# Altium schematic sheet MercAp PCB.SchDoc: EDP_Schematic
size A3 portrait; DocumentNumber: 1; Revision: 1; SheetNumber: 1; SheetTotal: 1; ENG_APP_DATE: --/--/--; DSN_APP_DATE: --/--/--; CHK_APP_DATE: --/--/--
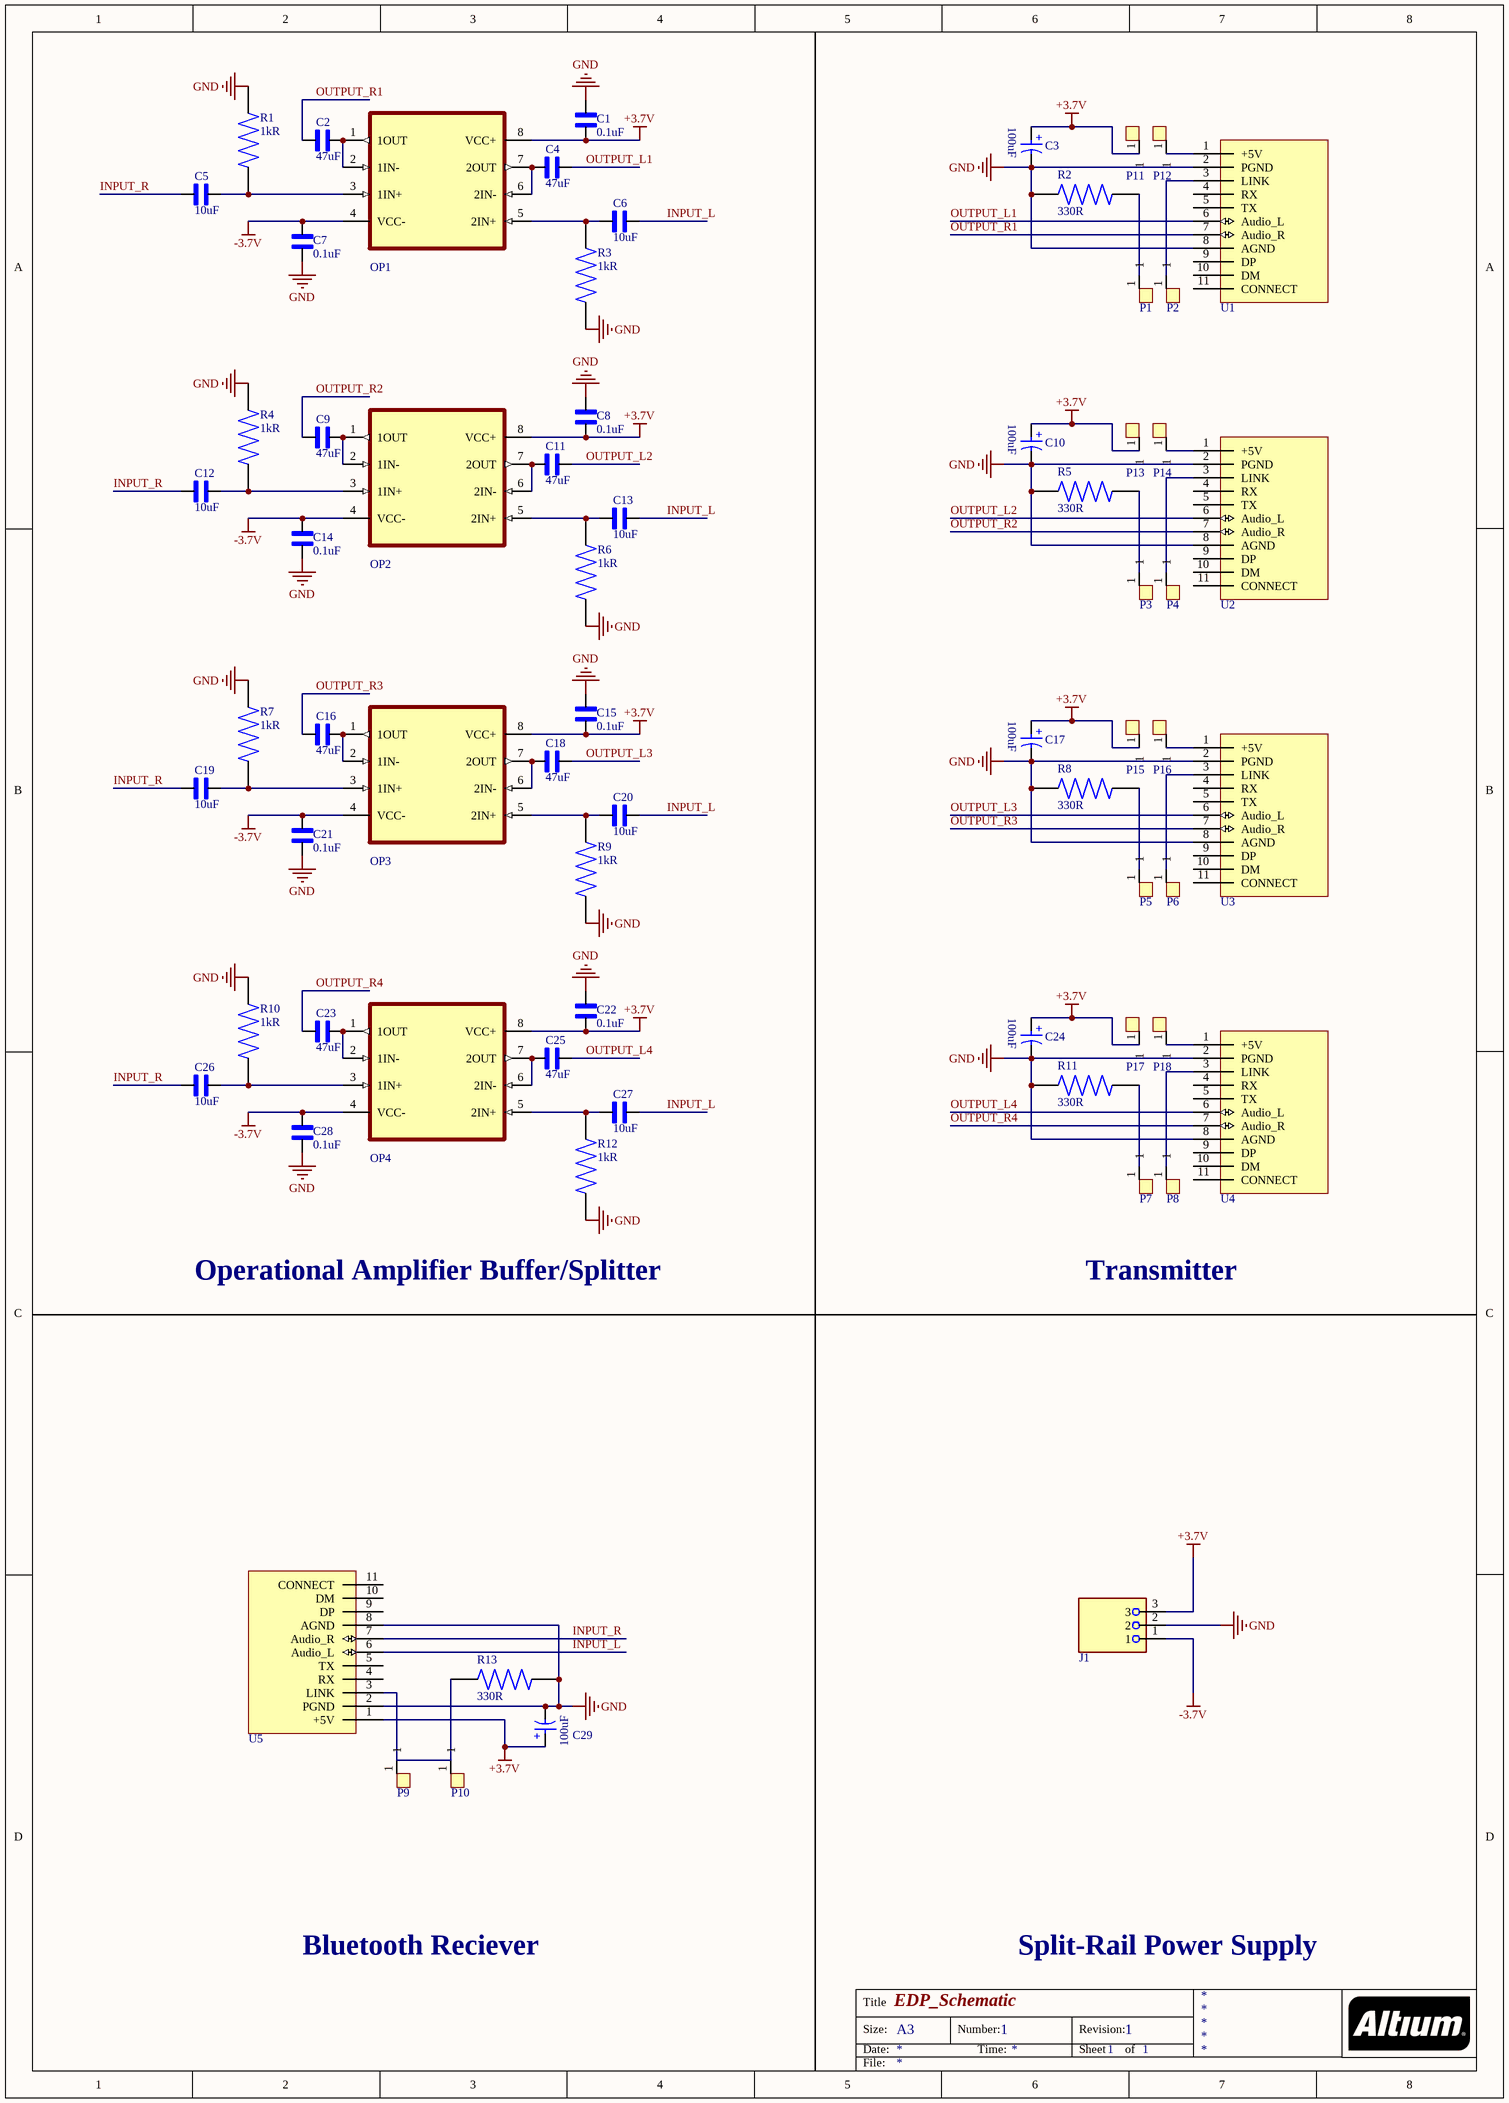
[diagram p0: MercAp PCB.SchDoc]

## Parts
C1  value 0.1uF  [CAPC1005X55N]  (hidden comment: CL05B104KP5NNNC)
C2  value 47uF  [CAPC2012X145N]  (hidden comment: JMK212BBJ476MG-T)
C3  865080343009  [WCAP-ASLI_D6.3H5.5]  (value not drawn)
C4  value 47uF  [CAPC2012X145N]  (hidden comment: JMK212BBJ476MG-T)
C5  value 10uF  [CAPC2012X135N]  (hidden comment: GRM21BR61C106KE15K)
C6  value 10uF  [CAPC2012X135N]  (hidden comment: GRM21BR61C106KE15K)
C7  value 0.1uF  [CAPC1005X55N]  (hidden comment: CL05B104KP5NNNC)
C8  value 0.1uF  [CAPC1005X55N]  (hidden comment: CL05B104KP5NNNC)
C9  value 47uF  [CAPC2012X145N]  (hidden comment: JMK212BBJ476MG-T)
C10  865080343009  [WCAP-ASLI_D6.3H5.5]  (value not drawn)
C11  value 47uF  [CAPC2012X145N]  (hidden comment: JMK212BBJ476MG-T)
C12  value 10uF  [CAPC2012X135N]  (hidden comment: GRM21BR61C106KE15K)
C13  value 10uF  [CAPC2012X135N]  (hidden comment: GRM21BR61C106KE15K)
C14  value 0.1uF  [CAPC1005X55N]  (hidden comment: CL05B104KP5NNNC)
C15  value 0.1uF  [CAPC1005X55N]  (hidden comment: CL05B104KP5NNNC)
C16  value 47uF  [CAPC2012X145N]  (hidden comment: JMK212BBJ476MG-T)
C17  865080343009  [WCAP-ASLI_D6.3H5.5]  (value not drawn)
C18  value 47uF  [CAPC2012X145N]  (hidden comment: JMK212BBJ476MG-T)
C19  value 10uF  [CAPC2012X135N]  (hidden comment: GRM21BR61C106KE15K)
C20  value 10uF  [CAPC2012X135N]  (hidden comment: GRM21BR61C106KE15K)
C21  value 0.1uF  [CAPC1005X55N]  (hidden comment: CL05B104KP5NNNC)
C22  value 0.1uF  [CAPC1005X55N]  (hidden comment: CL05B104KP5NNNC)
C23  value 47uF  [CAPC2012X145N]  (hidden comment: JMK212BBJ476MG-T)
C24  865080343009  [WCAP-ASLI_D6.3H5.5]  (value not drawn)
C25  value 47uF  [CAPC2012X145N]  (hidden comment: JMK212BBJ476MG-T)
C26  value 10uF  [CAPC2012X135N]  (hidden comment: GRM21BR61C106KE15K)
C27  value 10uF  [CAPC2012X135N]  (hidden comment: GRM21BR61C106KE15K)
C28  value 0.1uF  [CAPC1005X55N]  (hidden comment: CL05B104KP5NNNC)
C29  865080343009  [WCAP-ASLI_D6.3H5.5]  (value not drawn)
J1  1935174  [PHOENIX_1935174]  (value not drawn)
OP1  NE5532DR  [SOIC127P599X175-8N]  (value not drawn)
OP2  NE5532DR  [SOIC127P599X175-8N]  (value not drawn)
OP3  NE5532DR  [SOIC127P599X175-8N]  (value not drawn)
OP4  NE5532DR  [SOIC127P599X175-8N]  (value not drawn)
P1  LED_PAD  [SolderWirePad_1x01_SMD_5x10mm]  (value not drawn)
P2  LED_PAD  [SolderWirePad_1x01_SMD_5x10mm]  (value not drawn)
P3  LED_PAD  [SolderWirePad_1x01_SMD_5x10mm]  (value not drawn)
P4  LED_PAD  [SolderWirePad_1x01_SMD_5x10mm]  (value not drawn)
P5  LED_PAD  [SolderWirePad_1x01_SMD_5x10mm]  (value not drawn)
P6  LED_PAD  [SolderWirePad_1x01_SMD_5x10mm]  (value not drawn)
P7  LED_PAD  [SolderWirePad_1x01_SMD_5x10mm]  (value not drawn)
P8  LED_PAD  [SolderWirePad_1x01_SMD_5x10mm]  (value not drawn)
P9  LED_PAD  [SolderWirePad_1x01_SMD_5x10mm]  (value not drawn)
P10  LED_PAD  [SolderWirePad_1x01_SMD_5x10mm]  (value not drawn)
P11  LED_PAD  [SolderWirePad_1x01_SMD_5x10mm]  (value not drawn)
P12  LED_PAD  [SolderWirePad_1x01_SMD_5x10mm]  (value not drawn)
P13  LED_PAD  [SolderWirePad_1x01_SMD_5x10mm]  (value not drawn)
P14  LED_PAD  [SolderWirePad_1x01_SMD_5x10mm]  (value not drawn)
P15  LED_PAD  [SolderWirePad_1x01_SMD_5x10mm]  (value not drawn)
P16  LED_PAD  [SolderWirePad_1x01_SMD_5x10mm]  (value not drawn)
P17  LED_PAD  [SolderWirePad_1x01_SMD_5x10mm]  (value not drawn)
P18  LED_PAD  [SolderWirePad_1x01_SMD_5x10mm]  (value not drawn)
R1  value 1kR  [RESC1508X55N]  (hidden comment: RMCF0603FT1K00)
R2  value 330R  [RESC1608X55N]  (hidden comment: RC0603JR-07330RL)
R3  value 1kR  [RESC1508X55N]  (hidden comment: RMCF0603FT1K00)
R4  value 1kR  [RESC1508X55N]  (hidden comment: RMCF0603FT1K00)
R5  value 330R  [RESC1608X55N]  (hidden comment: RC0603JR-07330RL)
R6  value 1kR  [RESC1508X55N]  (hidden comment: RMCF0603FT1K00)
R7  value 1kR  [RESC1508X55N]  (hidden comment: RMCF0603FT1K00)
R8  value 330R  [RESC1608X55N]  (hidden comment: RC0603JR-07330RL)
R9  value 1kR  [RESC1508X55N]  (hidden comment: RMCF0603FT1K00)
R10  value 1kR  [RESC1508X55N]  (hidden comment: RMCF0603FT1K00)
R11  value 330R  [RESC1608X55N]  (hidden comment: RC0603JR-07330RL)
R12  value 1kR  [RESC1508X55N]  (hidden comment: RMCF0603FT1K00)
R13  value 330R  [RESC1608X55N]  (hidden comment: RC0603JR-07330RL)
U1  KCX_BT_v1.4  [kcx_bt_emitter_foot]  (value not drawn)
U2  KCX_BT_v1.4  [kcx_bt_emitter_foot]  (value not drawn)
U3  KCX_BT_v1.4  [kcx_bt_emitter_foot]  (value not drawn)
U4  KCX_BT_v1.4  [kcx_bt_emitter_foot]  (value not drawn)
U5  KCX_BT_v1.4  [kcx_bt_emitter_foot]  (value not drawn)

## Nets
+3.7V: C1.1 C3.1(P) C8.1 C10.1(P) C15.1 C17.1(P) C22.1 C24.1(P) C29.1(P) J1.3 OP1.8(VCC+) OP2.8(VCC+) OP3.8(VCC+) OP4.8(VCC+) U5.1(+5V)
-3.7V: C7.2 C14.2 C21.2 C28.2 J1.1 OP1.4(VCC-) OP2.4(VCC-) OP3.4(VCC-) OP4.4(VCC-)
GND: C1.2 C3.2(N) C7.1 C8.2 C10.2(N) C14.1 C15.2 C17.2(N) C21.1 C22.2 C24.2(N) C28.1 C29.2(N) J1.2 R1.1 R2.1 R3.1 R4.1 R5.1 R6.1 R7.1 R8.1 R9.1 R10.1 R11.1 R12.1 R13.1 U1.2(PGND) U1.8(AGND) U2.2(PGND) U2.8(AGND) U3.2(PGND) U3.8(AGND) U4.2(PGND) U4.8(AGND) U5.2(PGND) U5.8(AGND)
INPUT_L: C6.1 C13.1 C20.1 C27.1 U5.6(Audio_L)
INPUT_R: C5.1 C12.1 C19.1 C26.1 U5.7(Audio_R)
OUTPUT_L1: C4.2 U1.6(Audio_L)
OUTPUT_L2: C11.2 U2.6(Audio_L)
OUTPUT_L3: C18.2 U3.6(Audio_L)
OUTPUT_L4: C25.2 U4.6(Audio_L)
OUTPUT_R1: C2.1 U1.7(Audio_R)
OUTPUT_R2: C9.1 U2.7(Audio_R)
OUTPUT_R3: C16.1 U3.7(Audio_R)
OUTPUT_R4: C23.1 U4.7(Audio_R)
NetC2_2: C2.2 OP1.1(1OUT) OP1.2(1IN-)
NetC4_1: C4.1 OP1.6(2IN-) OP1.7(2OUT)
NetC5_2: C5.2 OP1.3(1IN+) R1.2
NetC6_2: C6.2 OP1.5(2IN+) R3.2
NetC9_2: C9.2 OP2.1(1OUT) OP2.2(1IN-)
NetC11_1: C11.1 OP2.6(2IN-) OP2.7(2OUT)
NetC12_2: C12.2 OP2.3(1IN+) R4.2
NetC13_2: C13.2 OP2.5(2IN+) R6.2
NetC16_2: C16.2 OP3.1(1OUT) OP3.2(1IN-)
NetC18_1: C18.1 OP3.6(2IN-) OP3.7(2OUT)
NetC19_2: C19.2 OP3.3(1IN+) R7.2
NetC20_2: C20.2 OP3.5(2IN+) R9.2
NetC23_2: C23.2 OP4.1(1OUT) OP4.2(1IN-)
NetC25_1: C25.1 OP4.6(2IN-) OP4.7(2OUT)
NetC26_2: C26.2 OP4.3(1IN+) R10.2
NetC27_2: C27.2 OP4.5(2IN+) R12.2
NetR13_2: R13.2 U5.3(LINK)

Not connected (* = marked no-connect by the designer): P1 1; P2 1; P3 1; P4 1; P5 1; P6 1; P7 1; P8 1; P9 1; P10 1; P11 1; P12 1; P13 1; P14 1; P15 1; P16 1; P17 1; P18 1; R2 2; R5 2; R8 2; R11 2; U1 1(+5V) 3(LINK) 4(RX) 5(TX) 9(DP) 10(DM) 11(CONNECT); U2 1(+5V) 3(LINK) 4(RX) 5(TX) 9(DP) 10(DM) 11(CONNECT); U3 1(+5V) 3(LINK) 4(RX) 5(TX) 9(DP) 10(DM) 11(CONNECT); U4 1(+5V) 3(LINK) 4(RX) 5(TX) 9(DP) 10(DM) 11(CONNECT); U5 4(RX) 5(TX) 9(DP) 10(DM) 11(CONNECT)

## Notes on the sheet
- Operational Amplifier Buffer/Splitter
- Transmitter
- Bluetooth Reciever
- Split-Rail Power Supply
- Title
- Size:
- Date:
- A3
- Number:
- Time:
- Revision:
- Sheet
- of
- File:
- (in symbol 865080343009) 100uF; +

## Library data of the parts
C1 C7 C8 C14 C15 C21 C22 C28 = CL05B104KP5NNNC: Ceramic Capacitor, Multilayer, Ceramic, 10V, 10% +Tol, 10% -Tol, X7R, 15% TC, 0.1uF, Surface Mount, 0402; Manufacturer: Samsung; Multilayer: Yes; Supplier: Digikey; Supplier Part Number: 1276-1002-1-ND; Manufacturer Part Number: CL05B104KP5NNNC; RoHS: Yes; Category: Ceramic Capacitors; Stock: 29763823; Pricing: 1=0.08, 10=0.004, 100=0.0036, 1000=0.0032 (USD); Mounting Technology: Surface Mount; Pins: 2; Dielectric Material: Ceramic; Package Shape: Rectangular; Case/Package: 0402; Terminal Finish: Nickel; Min Operating Temperature: -55°C; Max Operating Temperature: 125°C; JESD-609 Code: e3; Capacitor Type: Ceramic; Tolerance  (fill in as +-): 10%; Package Style: SMTMeter; Packaging: Tape and Reel; Tolerance (fill in as +-): 10%; Rated DC Voltage (URdc): 10V; Temperature Characteristics Code: X7R; Termination: Wraparound; Length: 1mm; Width: 0.5mm; Height: 0.5mm; Reach SVHC Compliant: Yes; RoHS Compliant: Yes; ComponentLink1URL: https://datasheet.ciiva.com:443/pdfs/VipMasterIC/IC/SEMS/SEMS-S-A0008523115/SEMS-S-A0008523129-1.pdf?src-supplier=IHS+Markit; ComponentLink1Description: https://datasheet.ciiva.com:443/pdfs/VipMasterIC/IC/SEMS/SEMS-S-A0008523115/SEMS-S-A0008523129-1.pdf?src-supplier=IHS+Markit; ComponentLink2URL: https://datasheet.ciiva.com/15165/getdatasheetpartid-37100-15165107.pdf?src-supplier=Verical; ComponentLink2Description: https://datasheet.ciiva.com/15165/getdatasheetpartid-37100-15165107.pdf?src-supplier=Verical; ComponentLink3URL: https://datasheet.ciiva.com/16498/cl05b104kq5nnnc-16498491.pdf?src-supplier=Future+Electronics; ComponentLink3Description: https://datasheet.ciiva.com/16498/cl05b104kq5nnnc-16498491.pdf?src-supplier=Future+Electronics
C2 C4 C9 C11 C16 C18 C23 C25 = JMK212BBJ476MG-T: Ceramic Capacitor, Multilayer, Ceramic, 6.3V, 20% +Tol, 20% -Tol, X5R, 15% TC, 47uF, Surface Mount, 0805; Manufacturer: Taiyo Yuden; Multilayer: Yes; Supplier: Digikey; Supplier Part Number: 587-4280-1-ND; Manufacturer Part Number: JMK212BBJ476MG-T; RoHS: Yes; Category: Ceramic Capacitors; Stock: 804956; Pricing: 1=0.32, 10=0.188, 100=0.122, 1000=0.08778 (USD); Mounting Technology: Surface Mount; Pins: 2; Dielectric Material: Ceramic; Package Shape: Rectangular; Case/Package: 0805; Terminal Finish: Nickel; Min Operating Temperature: -55°C; Max Operating Temperature: 85°C; JESD-609 Code: e3; Capacitor Type: Ceramic; Tolerance  (fill in as +-): 20%; Package Style: SMTMeter; Packaging: Tape and Reel; Tolerance (fill in as +-): 20%; Rated DC Voltage (URdc): 6.3V; Temperature Characteristics Code: X5R; Termination: Wraparound; Length: 2mm; Width: 1.25mm; Height: 1.25mm; Reach SVHC Compliant: Yes; RoHS Compliant: Yes; ComponentLink1URL: https://datasheet.ciiva.com:443/pdfs/VipMasterIC/IC/TAIY/TAIY-S-A0008883757/TAIY-S-A0008884245-1.pdf?src-supplier=IHS+Markit; ComponentLink1Description: https://datasheet.ciiva.com:443/pdfs/VipMasterIC/IC/TAIY/TAIY-S-A0008883757/TAIY-S-A0008884245-1.pdf?src-supplier=IHS+Markit; ComponentLink2URL: https://datasheet.ciiva.com/11596/jmk212bbj476mg-t-ss-11596928.pdf?src-supplier=Avnet; ComponentLink2Description: https://datasheet.ciiva.com/11596/jmk212bbj476mg-t-ss-11596928.pdf?src-supplier=Avnet
C3 C10 C17 C24 C29 = 865080343009: Aluminum Electrolytic Capacitor, Aluminum (wet); Manufacturer: Wurth Electronics; Dielectric Material: Aluminium; Supplier: Digikey; Supplier Part Number: 732-8419-1-ND; Manufacturer Part Number: 865080343009; RoHS: Yes; Category: Aluminum Electrolytic Capacitors; Stock: 49727; Pricing: 1=0.28, 50=0.241, 100=0.21, 250=0.186, 500=0.163 (USD); Pins: 2; Capacitor Type: Aluminium; Reach SVHC Compliant: Yes; RoHS Compliant: Yes; ComponentLink1URL: https://datasheet.ciiva.com:443/pdfs/VipMasterIC/IC/MIDC/MIDC-S-A0000770067/MIDC-S-A0000769899-1.pdf?src-supplier=IHS+Markit; ComponentLink1Description: https://datasheet.ciiva.com:443/pdfs/VipMasterIC/IC/MIDC/MIDC-S-A0000770067/MIDC-S-A0000769899-1.pdf?src-supplier=IHS+Markit; ComponentLink2URL: http://www.farnell.com/datasheets/1880126.pdf?src-supplier=Farnell; ComponentLink2Description: http://www.farnell.com/datasheets/1880126.pdf?src-supplier=Farnell; ComponentLink3URL: https://katalog.we-online.de/pbs/datasheet/865080343009.pdf?src-supplier=Digikey; ComponentLink3Description: https://katalog.we-online.de/pbs/datasheet/865080343009.pdf?src-supplier=Digikey; ComponentLink4URL: http://www.farnell.com/datasheets/1880126.pdf?src-supplier=Newark; ComponentLink4Description: http://www.farnell.com/datasheets/1880126.pdf?src-supplier=Newark; ComponentLink5URL: http://www.farnell.com/datasheets/1880126.pdf?src-supplier=Element14; ComponentLink5Description: http://www.farnell.com/datasheets/1880126.pdf?src-supplier=Element14
C5 C6 C12 C13 C19 C20 C26 C27 = GRM21BR61C106KE15K: Ceramic Capacitor, Multilayer, Ceramic, 16V, 10% +Tol, 10% -Tol, X5R, 15% TC, 10uF, Surface Mount, 0805; Manufacturer: Murata; Multilayer: Yes; Supplier: Digikey; Supplier Part Number: 490-6473-1-ND; Manufacturer Part Number: GRM21BR61C106KE15K; RoHS: Yes; Category: Ceramic Capacitors; Stock: 950706; Pricing: 1=0.14, 10=0.081, 100=0.0497, 1000=0.03306, 2500=0.0261 (USD); Mounting Technology: Surface Mount; Pins: 2; Dielectric Material: Ceramic; Package Shape: Rectangular; Case/Package: 0805; Terminal Finish: Nickel; Min Operating Temperature: -55°C; Max Operating Temperature: 85°C; JESD-609 Code: e3; Capacitor Type: Ceramic; Tolerance  (fill in as +-): 10%; Package Style: SMTMeter; Packaging: Tape and Reel; Tolerance (fill in as +-): 10%; Rated DC Voltage (URdc): 16V; Temperature Characteristics Code: X5R; Termination: Wraparound; Length: 2mm; Width: 1.25mm; Height: 1.25mm; Reach SVHC Compliant: Yes; RoHS Compliant: Yes; ComponentLink1URL: https://psearch.en.murata.com:443/capacitor/product/GRM21BR61C106KE15%23.pdf?src-supplier=IHS+Markit; ComponentLink1Description: https://psearch.en.murata.com:443/capacitor/product/GRM21BR61C106KE15%23.pdf?src-supplier=IHS+Markit; ComponentLink2URL: https://datasheet.ciiva.com/26822/getdatasheetpartid-31687-26822939.pdf?src-supplier=Verical; ComponentLink2Description: https://datasheet.ciiva.com/26822/getdatasheetpartid-31687-26822939.pdf?src-supplier=Verical; ComponentLink3URL: https://datasheet.ciiva.com/5414/product-5414934.pdf?src-supplier=Mouser; ComponentLink3Description: https://datasheet.ciiva.com/5414/product-5414934.pdf?src-supplier=Mouser; ComponentLink4URL: https://datasheet.ciiva.com/6270/partnumbering-e-01-6270407.pdf?src-supplier=Digikey; ComponentLink4Description: https://datasheet.ciiva.com/6270/partnumbering-e-01-6270407.pdf?src-supplier=Digikey; ComponentLink5URL: https://datasheet.ciiva.com/6270/partnumbering-e-01-6270410.pdf?src-supplier=Digikey; ComponentLink5Description: https://datasheet.ciiva.com/6270/partnumbering-e-01-6270410.pdf?src-supplier=Digikey; ComponentLink6URL: https://datasheet.ciiva.com/6270/partnumbering-e-01-6270412.pdf?src-supplier=Digikey; ComponentLink6Description: https://datasheet.ciiva.com/6270/partnumbering-e-01-6270412.pdf?src-supplier=Digikey
J1 = 1935174: Barrier Strip Terminal Block, 17.5A, 1.5mm2, 1 Row(s), 1 Deck(s); Manufacturer: Phoenix Contact; Fastening Method: SCREW; Number of Decks: 1; Number of Ways: 3; Voltage Rating: 250V; Wire/Cable Gauge: 14AWG; Safety Approval: UL; Supplier: Digikey; Supplier Part Number: 277-1578-ND; Manufacturer Part Number: 1935174; RoHS: Yes; Category: Terminal Blocks; Stock: 22673; Pricing: 1=1.04, 10=0.748, 25=0.6516, 50=0.5892, 100=0.5688 (USD); Mounting Technology: Board; Manufacturer Series: 1935174; Number of Rows: 1; Current Rating: 17.5A; Terminal and Terminal Block Type: BARRIER STRIP TERMINAL BLOCK; Wire Cross Section: 1.5mm2; RoHS Compliant: Yes; Reach SVHC Compliant: No; ComponentLink1URL: https://datasheet.ciiva.com:443/pdfs/VipMasterIC/IC/PCON/PCON-S-A0007661889/PCON-S-A0008047997-1.pdf?src-supplier=IHS+Markit; ComponentLink1Description: https://datasheet.ciiva.com:443/pdfs/VipMasterIC/IC/PCON/PCON-S-A0007661889/PCON-S-A0008047997-1.pdf?src-supplier=IHS+Markit; ComponentLink2URL: https://datasheet.ciiva.com/16047/1935174-16047249.pdf?src-supplier=Onlinecomponents.com; ComponentLink2Description: https://datasheet.ciiva.com/16047/1935174-16047249.pdf?src-supplier=Onlinecomponents.com; ComponentLink3URL: https://datasheet.ciiva.com/15169/getdatasheetpartid-212213-15169949.pdf?src-supplier=Verical; ComponentLink3Description: https://datasheet.ciiva.com/15169/getdatasheetpartid-212213-15169949.pdf?src-supplier=Verical; ComponentLink4URL: https://datasheet.ciiva.com/823/combiconcompact5-0mmseries-823761.pdf?src-supplier=Digikey; ComponentLink4Description: https://datasheet.ciiva.com/823/combiconcompact5-0mmseries-823761.pdf?src-supplier=Digikey; ComponentLink5URL: https://datasheet.ciiva.com/29218/744167-da-01-en-printklemme-pt-1-5-3-5-0-h-29218252.pdf?src-supplier=Conrad; ComponentLink5Description: https://datasheet.ciiva.com/29218/744167-da-01-en-printklemme-pt-1-5-3-5-0-h-29218252.pdf?src-supplier=Conrad
OP1-OP4 = NE5532DR: Operational Amplifier, 2 Func, 5000uV Offset-Max, BIPolar, PDSO8; Manufacturer: Texas Instruments; Package Body Material: Plastic; Architecture: VOLTAGE-FEEDBACK; Average Bias Current-Max (IIB): 1uA; Bias Current-Max (IIB) @25C: 800nA; Common-mode Reject Ratio-Nom: 100dB; Frequency Compensation: YES; Input Offset Voltage-Max: 5mV; Low-Offset: No; Neg Supply Voltage Limit-Max: -22V; Neg Supply Voltage-Nom (Vsup): -15V; Channels: 2; Power Supplies: +-5/+-15/10/30V; Slew Rate: 9V/µs; Max Supply Current: 16mA; Supply Voltage Limit-Max: 22V; Nominal Supply Voltage: 15V; Unity Gain BW-Nom: 10MHz; Voltage Gain-Min: 10000; Package Equivalence Code: SOP8,.25; Qualification Status: Not Qualified; Supplier: Digikey; Supplier Part Number: 296-13622-1-ND; Manufacturer Part Number: NE5532DR; RoHS: Yes; Category: Amplifiers - Op Amps, Buffer, Instrumentation; Stock: 16144; Pricing: 1=0.39, 10=0.269, 25=0.2392, 100=0.2066, 250=0.19116, 500=0.18184, 1000=0.17415 (USD); Case/Package: SOP; Pins: 8; Package Shape: Rectangular; Terminal Finish: Tin; Min Operating Temperature: 0°C; Max Operating Temperature: 70°C; JESD-609 Code: e3; Amplifier Type: OPERATIONAL AMPLIFIER; JESD-30 Code: R-PDSO-G8; Package Style: SMALL OUTLINEMeter; Packaging: Tape and Reel; Surface Mount: Yes; Technology: BIPOLAR; Terminal Form: Gull Wing; Terminal Position: DUAL; Peak Reflow Temperature (Cel): 260°C; Moisture Sensitivity Level: 1; Length: 4.9mm; Width: 3.9mm; Height - Seated (Max): 1.75mm; Terminal Pitch: 1.27mm; Temperature Grade: COMMERCIAL; RoHS Compliant: Yes; Reach SVHC Compliant: Yes; ComponentLink1URL: https://www.ti.com:443/lit/ds/symlink/ne5532.pdf?src-supplier=IHS+Markit; ComponentLink1Description: https://www.ti.com:443/lit/ds/symlink/ne5532.pdf?src-supplier=IHS+Markit; ComponentLink2URL: https://datasheet.ciiva.com/1796/ne5532-1796189.pdf?src-supplier=Digikey; ComponentLink2Description: https://datasheet.ciiva.com/1796/ne5532-1796189.pdf?src-supplier=Digikey; ComponentLink3URL: https://datasheet.ciiva.com/1796/ne5532-1796190.pdf?src-supplier=Digikey; ComponentLink3Description: https://datasheet.ciiva.com/1796/ne5532-1796190.pdf?src-supplier=Digikey; ComponentLink4URL: https://datasheet.ciiva.com/1796/ne5532-1796191.pdf?src-supplier=Digikey; ComponentLink4Description: https://datasheet.ciiva.com/1796/ne5532-1796191.pdf?src-supplier=Digikey
R1 R3 R4 R6 R7 R9 R10 R12 = RMCF0603FT1K00: Fixed Resistor, Metal Glaze/thick Film, 0.1W, 1000ohm, 75V, 1% +/-Tol, 100ppm/Cel, Surface Mount, 0603; Manufacturer: Stackpole Electronics; Power: 100mW; Rated Temperature: 70°C; Temperature Coefficient (ppm/Cel): 100; Package Height: 0.45mm; Package Length: 1.55mm; Package Width: 0.8mm; Reference Standard: AEC-Q200; Supplier: Digikey; Supplier Part Number: RMCF0603FT1K00CT-ND; Manufacturer Part Number: RMCF0603FT1K00; RoHS: Yes; Category: Chip SMD Resistors; Stock: 3461176; Pricing: 1=0.1, 10=0.02, 100=0.0091, 1000=0.0048, 2500=0.00386 (USD); Mounting Technology: Surface Mount; Pins: 2; Package Shape: Rectangular; Case/Package: 0603; Terminal Finish: Nickel; Min Operating Temperature: -55°C; Max Operating Temperature: 155°C; Tolerance: 1%; JESD-609 Code: e3; Resistor Type: FIXED RESISTOR; Construction: Rectangular; Packaging: Tape and Reel; Technology: METAL GLAZE/THICK FILM; Termination: Wraparound; Working Voltage: 75V; Reach SVHC Compliant: Yes; RoHS Compliant: Yes; ComponentLink1URL: https://datasheet.ciiva.com:443/pdfs/VipMasterIC/IC/SEIE/SEIE-S-A0009541969/SEIE-S-A0009541969-1.pdf?src-supplier=IHS+Markit; ComponentLink1Description: https://datasheet.ciiva.com:443/pdfs/VipMasterIC/IC/SEIE/SEIE-S-A0009541969/SEIE-S-A0009541969-1.pdf?src-supplier=IHS+Markit; ComponentLink2URL: https://datasheet.octopart.com/RMCF0603FT1K00-Stackpole-Electronics-datasheet-11547379.pdf?src-supplier=Future+Electronics; ComponentLink2Description: https://datasheet.octopart.com/RMCF0603FT1K00-Stackpole-Electronics-datasheet-11547379.pdf?src-supplier=Future+Electronics; ComponentLink3URL: https://www.seielect.com/catalog/SEI-Packaging.pdf?src-supplier=Avnet; ComponentLink3Description: https://www.seielect.com/catalog/SEI-Packaging.pdf?src-supplier=Avnet; ComponentLink4URL: https://www.seielect.com/catalog/SEI-Packaging.pdf?src-supplier=Arrow+Electronics; ComponentLink4Description: https://www.seielect.com/catalog/SEI-Packaging.pdf?src-supplier=Arrow+Electronics; ComponentLink5URL: http://www.seielect.com/Catalog/SEI-rmc.pdf?src-supplier=Future+Electronics; ComponentLink5Description: http://www.seielect.com/Catalog/SEI-rmc.pdf?src-supplier=Future+Electronics; ComponentLink6URL: https://www.seielect.com/catalog/SEI-Packaging.pdf?src-supplier=Verical; ComponentLink6Description: https://www.seielect.com/catalog/SEI-Packaging.pdf?src-supplier=Verical; ComponentLink7URL: https://www.seielect.com/catalog/SEI-RMCF_RMCP.pdf?src-supplier=Avnet; ComponentLink7Description: https://www.seielect.com/catalog/SEI-RMCF_RMCP.pdf?src-supplier=Avnet; ComponentLink8URL: https://www.seielect.com/catalog/sei-rmcf_rmcp.pdf?src-supplier=Digikey; ComponentLink8Description: https://www.seielect.com/catalog/sei-rmcf_rmcp.pdf?src-supplier=Digikey; ComponentLink9URL: https://www.seielect.com/catalog/SEI-Packaging.pdf?src-supplier=Quest; ComponentLink9Description: https://www.seielect.com/catalog/SEI-Packaging.pdf?src-supplier=Quest; ComponentLink10URL: https://datasheet.octopart.com/RMCF0603FT1K00-Stackpole-Electronics-datasheet-155966809.pdf?src-supplier=Master+Electronics; ComponentLink10Description: https://datasheet.octopart.com/RMCF0603FT1K00-Stackpole-Electronics-datasheet-155966809.pdf?src-supplier=Master+Electronics
R2 R5 R8 R11 R13 = RC0603JR-07330RL: Fixed Resistor, Metal Glaze/thick Film, 0.1W, 330ohm, 75V, 5% +/-Tol, 100ppm/Cel, Surface Mount, 0603; Manufacturer: Yageo; Additional Feature: LASER TRIMMABLE; Power: 100mW; Rated Temperature: 70°C; Temperature Coefficient (ppm/Cel): 100; Package Height: 0.45mm; Package Length: 1.6mm; Package Width: 0.8mm; Supplier: Digikey; Supplier Part Number: 311-330GRCT-ND; Manufacturer Part Number: RC0603JR-07330RL; RoHS: Yes; Category: Chip SMD Resistors; Stock: 1661244; Pricing: 1=0.1, 10=0.006, 50=0.0056, 100=0.0051, 500=0.00502 (USD); Mounting Technology: Surface Mount; Pins: 2; Package Shape: Rectangular; Case/Package: 0603; Terminal Finish: Nickel; Min Operating Temperature: -55°C; Max Operating Temperature: 155°C; Tolerance: 5%; JESD-609 Code: e3; Resistor Type: FIXED RESISTOR; Construction: Chip; Packaging: Tape and Reel; Technology: METAL GLAZE/THICK FILM; Termination: Wraparound; Working Voltage: 75V; Reach SVHC Compliant: Yes; RoHS Compliant: Yes; ComponentLink1URL: https://datasheet.ciiva.com:443/pdfs/VipMasterIC/IC/YAGO/YAGO-S-A0008145938/YAGO-S-A0008145938-1.pdf?src-supplier=IHS+Markit; ComponentLink1Description: https://datasheet.ciiva.com:443/pdfs/VipMasterIC/IC/YAGO/YAGO-S-A0008145938/YAGO-S-A0008145938-1.pdf?src-supplier=IHS+Markit; ComponentLink2URL: https://datasheet.ciiva.com/46395/443971-46395145.pdf?src-supplier=Element14; ComponentLink2Description: https://datasheet.ciiva.com/46395/443971-46395145.pdf?src-supplier=Element14; ComponentLink3URL: https://datasheet.ciiva.com/12558/rc0603-272842-12558685.pdf?src-supplier=Mouser; ComponentLink3Description: https://datasheet.ciiva.com/12558/rc0603-272842-12558685.pdf?src-supplier=Mouser; ComponentLink4URL: https://datasheet.ciiva.com/7746/1868787-7746487.pdf?src-supplier=Element14; ComponentLink4Description: https://datasheet.ciiva.com/7746/1868787-7746487.pdf?src-supplier=Element14; ComponentLink5URL: https://datasheet.ciiva.com/7746/443971-7746488.pdf?src-supplier=Element14; ComponentLink5Description: https://datasheet.ciiva.com/7746/443971-7746488.pdf?src-supplier=Element14